# EAGLE schematic FEE_v0.3 (EAGLE 9.6.2)
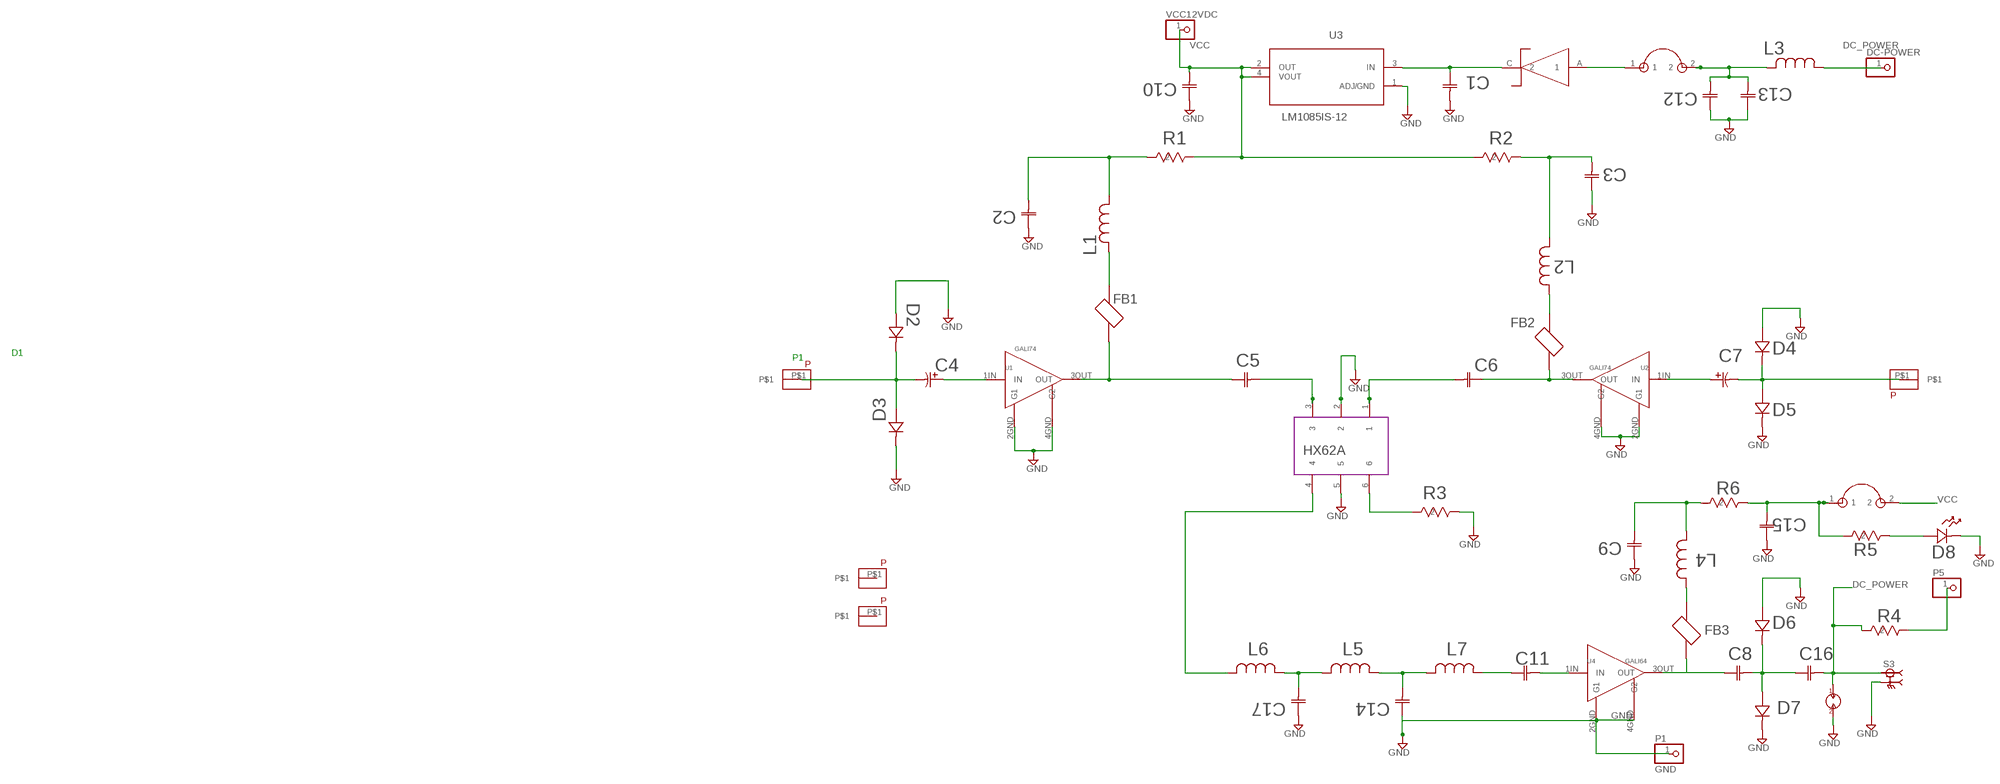
[diagram p0: schematic, sheet 1]

## Parts
C1  F931E106MCC  [F93-C_AVX]
C2  C1206C104G5JAC7800  [CAPC340180_135N_KEM]
C3  C1206C104G5JAC7800  [CAPC340180_135N_KEM]
C4  ECJ-3FB2J102K  [CC1206_3_PAN]
C5  C1206C104G5JAC7800  [CAPC340180_135N_KEM]
C6  C1206C104G5JAC7800  [CAPC340180_135N_KEM]
C7  ECJ-3FB2J102K  [CC1206_3_PAN]
C8  C1206C104G5JAC7800  [CAPC340180_135N_KEM]
C9  C1206C104G5JAC7800  [CAPC340180_135N_KEM]
C10  F931E106MCC  [F93-C_AVX]
C11  C1206C104G5JAC7800  [CAPC340180_135N_KEM]
C12  C1206C104G5JAC7800  [CAPC340180_135N_KEM]
C13  C1206C104G5JAC7800  [CAPC340180_135N_KEM]
C14  06031A330GAT2A  [CAP_0603G_AVX]
C15  C1206C104G5JAC7800  [CAPC340180_135N_KEM]
C16  C1206C104G5JAC7800  [CAPC340180_135N_KEM]
C17  06031A330GAT2A  [CAP_0603G_AVX]
D1  DIOM5436X247N  [DIOM5436X247N]
D2  1N4148WX-TP  [CR_SOD323_MCC]
D3  1N4148WX-TP  [CR_SOD323_MCC]
D4  1N4148WX-TP  [CR_SOD323_MCC]
D5  1N4148WX-TP  [CR_SOD323_MCC]
D6  1N4148WX-TP  [CR_SOD323_MCC]
D7  1N4148WX-TP  [CR_SOD323_MCC]
D8  SML-LX1206SIC-TR  [LED_SML-LX1206SIC-TR_LUM]
DC-POWER  PINHD-1X1  [1X01]
FB1  HZ0805C202R-10  [FB_HZ0805C202R-10]
FB2  HZ0805C202R-10  [FB_HZ0805C202R-10]
FB3  HZ0805C202R-10  [FB_HZ0805C202R-10]
L1  AISC-1008-4R7J-T  [AISC-1008_ABR]
L2  AISC-1008-4R7J-T  [AISC-1008_ABR]
L3  AISC-1008-4R7J-T  [AISC-1008_ABR]
L4  AISC-1008-4R7J-T  [AISC-1008_ABR]
L5  AISC-1008-4R7J-T  [AISC-1008_ABR]
L6  AISC-1008-4R7J-T  [AISC-1008_ABR]
L7  AISC-1008-4R7J-T  [AISC-1008_ABR]
P1  GND  PINHD-1X1  [1X01]
P5  PINHD-1X1  [1X01]
R1  ERJ-1TYJ910U  [RC2512N_PAN]
R2  ERJ-1TYJ910U  [RC2512N_PAN]
R3  ERJ-P08J510V  [RC1206N_PAN]
R4  ERJ-8GEYJ472V  [RC1206N_PAN]
R5  ERJ-8GEYJ471V  [RC1206N_PAN]
R6  ERJ-1TNF95R3U  [RC2512N_PAN]
S3  142-0701-201  [JOHNSON_142-0701-201]
U1  GALI74  [DF782]
U2  GALI74  [DF782]
U3  LM1085IS-12  [TO254P1435X457-3N]
U4  GALI64  [DF782]
U$1  P  [P]
U$2  P  [P]
U$3  P  [P]
U$4  P  [P]
U$5  JMP1,JMP2  [JMP1,JMP2]
U$6  JMP1,JMP2  [JMP1,JMP2]
U$7  HX62A  [HX62A]
U$8  GDTI  [GDTI]
VCC12VDC  PINHD-1X1  [1X01]

## Nets
DC_POWER: C16.2 DC-POWER.1 L3.1 R4.2 S3.1 U$8.1
GND: C1.2 C2.1 C3.1 C9.1 C10.1 C12.1 C13.1 C14.1 C15.1 C17.1 D2.2 D3.1 D4.2 D5.1 D6.2 D7.1 D8.1 P1.1 R3.1 S3.2 S3.3 S3.4 S3.5 U1.2GND(G1) U1.4GND(G2) U2.2GND(G1) U2.4GND(G2) U3.1(ADJ/GND) U4.2GND(G1) U4.4GND(G2) U$7.2 U$7.5 U$8.2
N$1: C4.1 U1.1IN(IN)
N$2: C4.2 D2.1 D3.2 U$1.P$1
N$3: C5.1 FB1.1 U1.3OUT(OUT)
N$4: FB1.2 L1.2
N$5: C2.2 L1.1 R1.2
N$6: C5.2 U$7.3
N$7: C6.2 U$7.1
N$8: R3.2 U$7.6
N$9: L6.2 U$7.4
N$10: C17.2 L5.2 L6.1
N$11: C14.2 L5.1 L7.2
N$12: C11.1 L7.1
N$13: C11.2 U4.1IN(IN)
N$14: C8.1 FB3.1 U4.3OUT(OUT)
N$15: FB3.2 L4.2
N$16: C9.2 L4.1 R6.2
N$17: C8.2 C16.1 D6.1 D7.2
N$19: C15.2 R5.2 R6.1 U$6.1
N$20: D8.2 R5.1
N$21: C6.1 FB2.1 U2.3OUT(OUT)
N$22: FB2.2 L2.2
N$23: C3.2 L2.1 R2.1
N$25: C1.1 D1.C U3.3(IN)
N$26: D1.A U$5.1
N$27: C12.2 C13.2 L3.2 U$5.2
N$28: C7.1 U2.1IN(IN)
N$29: C7.2 D4.1 D5.2 U$2.P$1
N$31: P5.1 R4.1
VCC: C10.2 R1.1 R2.2 U3.2(OUT) U3.4(VOUT) U$6.2 VCC12VDC.1
Unconnected: U$3.P$1 U$4.P$1

## Notes on the sheet
- D1
- P1

## Library data of the parts
C1 C10 = C1-C10_F931E106MCC:F931E106MCC; BUILT_BY: EMA_UL_Team; COPYRIGHT: Copyright (C) 2018 Accelerated Designs. All rights reserved; MANUFACTURER_PART_NUMBER: F931E106MCC; SOURCELIBRARY: AVX_2015-1-12; VENDOR: AVX Corporation
C2 C3 C5 C6 C8 C9 C11-C13 C15 C16 = C2-C3-C5-C6-C8-C9-C11-C12-C15_ECJ-3VB1E104K-C1206C104G5JAC7800:C1206C104G5JAC7800; BUILT_BY: EMA_Frank; MANUFACTURER_PART_NUMBER: C1206C104G5JAC7800; SOURCELIBRARY: Kemet_2020-03-25_1a; VENDOR: Kemet
C4 C7 = C4-C7_ECJ3FB2J102K:ECJ-3FB2J102K; BUILT_BY: EMA_UL_Team; MANUFACTURER_PART_NUMBER: ECJ-3FB2J102K; SOURCELIBRARY: Panasonic_2014-06-20; VENDOR: Panasonic
C14 C17 = C14-C17_06031A330GAT2A:06031A330GAT2A; BUILT_BY: EMA_UL_Team; COPYRIGHT: Copyright (C) 2018 Accelerated Designs. All rights reserved; MANUFACTURER_PART_NUMBER: 06031A330GAT2A; SOURCELIBRARY: AVX_2016-12-14_1; VENDOR: AVX Corporation
D1 = D1_DIOM5436X247N:DIOM5436X247N
D2-D7 = D2-D3-D4-D5-D6-D7_1N4148WXTP:1N4148WX-TP; BUILT_BY: EMA_Cory; COPYRIGHT: Copyright (C) 2018 Accelerated Designs. All rights reserved; DATASHEET: https://www.mccsemi.com/pdf/Products/1N4148WX(SOD323).pdf; MANUFACTURER_PART_NUMBER: 1N4148WX-TP; SOURCELIBRARY: MCC_2020-05-08; VENDOR: Micro Commercial Co
D8 = D8_SMLLX1206SICTR:SML-LX1206SIC-TR; BUILT_BY: EMA_Cory; COPYRIGHT: Copyright (C) 2018 Accelerated Designs. All rights reserved; DATASHEET: https://www.lumex.com/datasheet/SML-LX1206SIC-TR; MANUFACTURER_PART_NUMBER: SML-LX1206SIC-TR; SOURCELIBRARY: Add_to_database_2020-12-14; VENDOR: Lumex
DC-POWER P1 P5 VCC12VDC = pinhead:PINHD-1X1: PIN HEADER
FB1-FB3 = FB1-FB2-FB3_HZ0805C202R-10:HZ0805C202R-10; DESCRIPTION: 2 kOhms @ 100MHz 1 Signal Line Ferrite Bead 0805 (2012 Metric) 300mA 500mOhm; DIGI-KEY_PART_NUMBER: 240-2396-1-ND; MF: Laird-Signal Integrity; MP: HZ0805C202R-10; PACKAGE: 0805 Laird
L1-L7 = L1-L2-L4_AISC10084R7JT:AISC-1008-4R7J-T; BUILT_BY: EMA_UL_Team; MANUFACTURER_PART_NUMBER: AISC-1008-4R7J-T; SOURCELIBRARY: Abracon_2013_02_05_AISC-1008_Series; VENDOR: Abracon
R1 R2 = R1-R2_ERJ1TYJ910U:ERJ-1TYJ910U; BUILT_BY: EMA_UL_Team; MANUFACTURER_PART_NUMBER: ERJ-1TYJ910U; SOURCELIBRARY: Panasonic_2010-01-01_Res4; VENDOR: Panasonic
R3 = R3_ERJP08J510V:ERJ-P08J510V; BUILT_BY: EMA_UL_Team; MANUFACTURER_PART_NUMBER: ERJ-P08J510V; SOURCELIBRARY: Panasonic_2010-01-01_Res8; VENDOR: Panasonic
R4 = R4_ERJ8GEYJ472V:ERJ-8GEYJ472V; BUILT_BY: EMA_UL_Team; MANUFACTURER_PART_NUMBER: ERJ-8GEYJ472V; SOURCELIBRARY: Panasonic_2010-01-01_Res7; VENDOR: Panasonic
R5 = R5_ERJ8GEYJ471V:ERJ-8GEYJ471V; BUILT_BY: EMA_UL_Team; MANUFACTURER_PART_NUMBER: ERJ-8GEYJ471V; SOURCELIBRARY: Panasonic_2010-01-01_Res7; VENDOR: Panasonic
R6 = R6_ERJ1TNF95R3U:ERJ-1TNF95R3U; BUILT_BY: EMA_UL_Team; MANUFACTURER_PART_NUMBER: ERJ-1TNF95R3U; SOURCELIBRARY: Panasonic_2010-01-01_Res3; VENDOR: Panasonic
S3 = S3_01_142-0701-201:142-0701-201: Johnson Components 142-0701-201 / Conn Recept Straight Pcb .155"" Check prices <https://pricing.snapeda.com/parts/142-0701-201/Cinch%20Connectivity%20Solutions%20Johnson/view-part?ref=eda>; AVAILABILITY: In Stock; DESCRIPTION: SMA Connector Jack, Female Socket 50Ohm Through Hole Solder; MF: Cinch Connectivity Solutions Johnson; MP: 142-0701-201; PACKAGE: None; PRICE: None
U1 U2 = U1-U2-U4_GALI74:GALI74: MiniCircuits GALI-74+ amplifier Check prices <https://pricing.snapeda.com/parts/GALI-74%2B/Mini-Circuits/view-part?ref=eda>; AVAILABILITY: In Stock; DESCRIPTION: RF Amplifier IC Cellular 0Hz ~ 1GHz SOT-89; MF: Mini-Circuits; MP: GALI-74+; PACKAGE: None; PRICE: None
U3 = U3_LM1085IS-12:LM1085IS-12: Low Dropout Positive Regulators; DESCRIPTION: Linear Voltage Regulator IC Positive Fixed 1 Output 3A DDPAK/TO-263-3; DIGI-KEY_PART_NUMBER: LM1085IS-12/NOPB-ND; MF: Texas Instruments; MP: LM1085IS-12; PACKAGE: TO-263 Texas Instruments
U4 = U4_GALI64:GALI64: MiniCircuits GALI-74+ amplifier Check prices <https://pricing.snapeda.com/parts/GALI-74%2B/Mini-Circuits/view-part?ref=eda>; AVAILABILITY: In Stock; DESCRIPTION: RF Amplifier IC Cellular 0Hz ~ 1GHz SOT-89; MF: Mini-Circuits; MP: GALI-74+; PACKAGE: None; PRICE: None
U$1-U$4 = P:P
U$5 U$6 = JMP1,JMP2:JMP1,JMP2
U$7 = HX62A:HX62A
U$8 = GDTI:GDTI